# Altium schematic sheet main.SchDoc
size A4
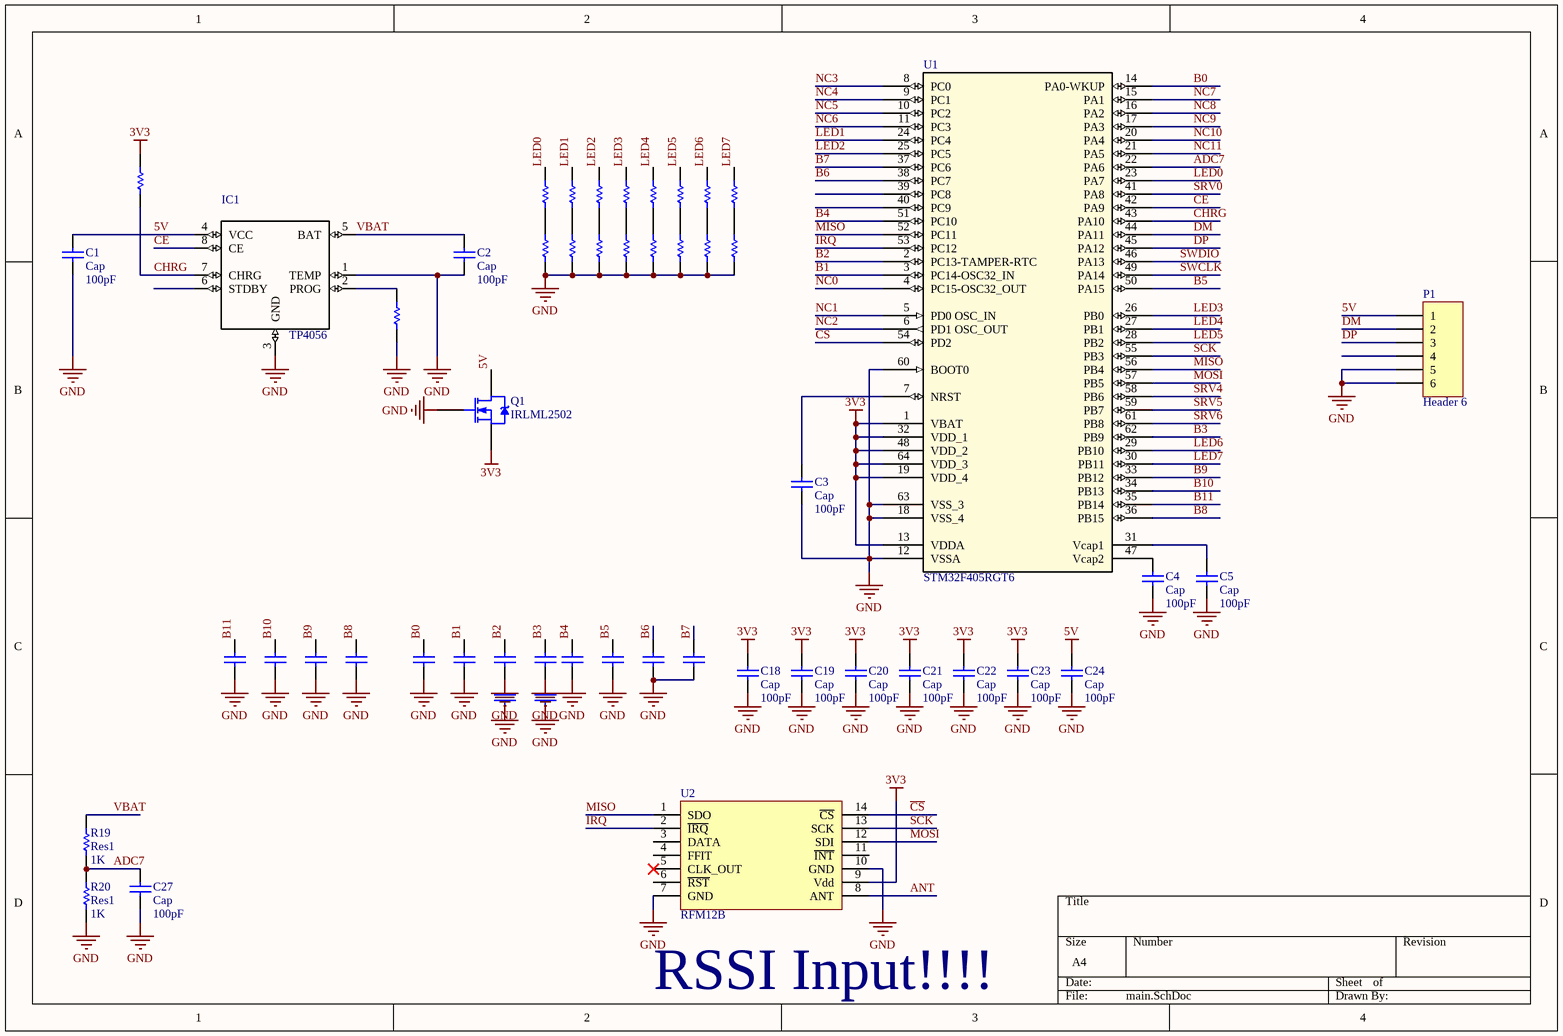
[diagram p0: main.SchDoc]

## Parts
C1  Cap  value 100pF  [RC_1210_T1.8]
C2  Cap  value 100pF  [RC_1210_T1.8]
C3  Cap  value 100pF  [RC_0603]
C4  Cap  value 100pF  [RC_0603]
C5  Cap  value 100pF  [RC_0603]
C6  Cap  [RC_0603]  (value not drawn)
C7  Cap  [RC_0603]  (value not drawn)
C8  Cap  [RC_0603]  (value not drawn)
C9  Cap  [RC_0603]  (value not drawn)
C10  Cap  [RC_0603]  (value not drawn)
C11  Cap  [RC_0603]  (value not drawn)
C12  Cap  [RC_0603]  (value not drawn)
C13  Cap  [RC_0603]  (value not drawn)
C14  Cap  [RC_0603]  (value not drawn)
C15  Cap  [RC_0603]  (value not drawn)
C16  Cap  [RC_0603]  (value not drawn)
C17  Cap  [RC_0603]  (value not drawn)
C18  Cap  value 100pF  [RC_0603]
C19  Cap  value 100pF  [RC_0603]
C20  Cap  value 100pF  [RC_0603]
C21  Cap  value 100pF  [RC_0603]
C22  Cap  value 100pF  [RC_0603]
C23  Cap  value 100pF  [RC_0603]
C24  Cap  value 100pF  [RC_0603]
C25  Cap  [RC_0603]  (value not drawn)
C26  Cap  [RC_0603]  (value not drawn)
C27  Cap  value 100pF  [RC_0603]
IC1  TP4056  [*SOP-8]
P1  Header 6  [RR_USB_MICRO_#1]
Q1  IRLML2502  [RR_SOT-23]
R1  Res1  [RR_0603]  (value not drawn)
R2  Res1  [RR_0603]  (value not drawn)
R3  Res1  [RR_0603]  (value not drawn)
R4  Res1  [RR_0603]  (value not drawn)
R5  Res1  [RR_0603]  (value not drawn)
R6  Res1  [RR_0603]  (value not drawn)
R7  Res1  [RR_0603]  (value not drawn)
R8  Res1  [RR_0603]  (value not drawn)
R9  Res1  [RR_0603]  (value not drawn)
R10  Res1  [RR_0603]  (value not drawn)
R11  Res1  [RR_0603]  (value not drawn)
R12  Res1  [RR_0603]  (value not drawn)
R13  Res1  [RR_0603]  (value not drawn)
R14  Res1  [RR_0603]  (value not drawn)
R15  Res1  [RR_0603]  (value not drawn)
R16  Res1  [RR_0603]  (value not drawn)
R17  Res1  [RR_0603]  (value not drawn)
R18  Res1  [RR_0603]  (value not drawn)
R19  Res1  value 1K  [RR_0603]
R20  Res1  value 1K  [RR_0603]
U1  STM32F405RGT6  [RR_LQFP-64]
U2  RFM12B

## Nets
3V3: C18.2 C19.2 C20.2 C21.2 C22.2 C23.2 Q1.2(S) R1.2 U1.1(VBAT) U1.13(VDDA) U1.19(VDD_4) U1.32(VDD_1) U1.48(VDD_2) U1.64(VDD_3) U2.9(Vdd)
5V: C1.2 C24.2 IC1.4(VCC) P1.1 Q1.3(D)
GND: C1.1 C2.1 C3.1 C4.1 C5.1 C6.1 C7.1 C8.1 C9.1 C10.1 C11.1 C12.1 C13.1 C14.1 C15.1 C16.1 C17.1 C18.1 C19.1 C20.1 C21.1 C22.1 C23.1 C24.1 C27.1 IC1.1(TEMP) IC1.3(GND) P1.5 P1.6 Q1.1(G) R10.1 R11.1 R12.1 R13.1 R14.1 R15.1 R16.1 R17.1 R18.1 R20.1 U1.12(VSSA) U1.18(VSS_4) U1.60(BOOT0) U1.63(VSS_3) U2.7(GND) U2.10(GND)
ADC7: C27.2 R19.1 R20.2 U1.22(PA6)
ANT: U2.8(ANT)
B0: C10.2 U1.14(PA0-WKUP)
B1: C11.2 U1.3(PC14-OSC32_IN)
B2: C12.2 U1.2(PC13-TAMPER-RTC)
B3: C13.2 U1.62(PB9)
B4: C14.2 U1.51(PC10)
B5: C15.2 U1.50(PA15)
B6: C16.2 U1.38(PC7)
B7: C17.2 U1.37(PC6)
B8: C9.2 U1.36(PB15)
B9: C8.2 U1.33(PB12)
B10: C7.2 U1.34(PB13)
B11: C6.2 U1.35(PB14)
~{CS}: U1.54(PD2) U2.14(~{CS})
CE: IC1.8(CE) U1.42(PA9)
CHRG: IC1.7(CHRG) R1.1 U1.43(PA10)
DM: P1.2 U1.44(PA11)
DP: P1.3 U1.45(PA12)
~{IRQ}: U1.53(PC12) U2.2(~{IRQ})
LED0: R2.2 U1.23(PA7)
LED1: R3.2 U1.24(PC4)
LED2: R4.2 U1.25(PC5)
LED3: R5.2 U1.26(PB0)
LED4: R6.2 U1.27(PB1)
LED5: R7.2 U1.28(PB2)
LED6: R8.2 U1.29(PB10)
LED7: R9.2 U1.30(PB11)
MISO: U1.52(PC11) U1.56(PB4) U2.1(SDO)
MOSI: U1.57(PB5) U2.12(SDI)
NC0: U1.4(PC15-OSC32_OUT)
NC1: U1.5(PD0_OSC_IN)
NC2: U1.6(PD1_OSC_OUT)
NC3: U1.8(PC0)
NC4: U1.9(PC1)
NC5: U1.10(PC2)
NC6: U1.11(PC3)
NC7: U1.15(PA1)
NC8: U1.16(PA2)
NC9: U1.17(PA3)
NC10: U1.20(PA4)
NC11: U1.21(PA5)
SCK: U1.55(PB3) U2.13(SCK)
SRV0: U1.41(PA8)
SRV4: U1.58(PB6)
SRV5: U1.59(PB7)
SRV6: U1.61(PB8)
SWCLK: U1.49(PA14)
SWDIO: U1.46(PA13)
VBAT: C2.2 IC1.5(BAT) R19.2
NetC3_2: C3.2 U1.7(NRST)
NetC4_2: C4.2 U1.47(Vcap2)
NetC5_2: C5.2 U1.31(Vcap1)
NetIC1_2: IC1.2(PROG) R18.2
NetR2_1: R2.1 R10.2
NetR3_1: R3.1 R11.2
NetR4_1: R4.1 R12.2
NetR5_1: R5.1 R13.2
NetR6_1: R6.1 R14.2
NetR7_1: R7.1 R15.2
NetR8_1: R8.1 R16.2
NetR9_1: R9.1 R17.2

Not connected (* = marked no-connect by the designer): C25 1 2; C26 1 2; IC1 6(STDBY); P1 4; U1 39(PC8) 40(PC9); U2 3(DATA) 4(FFIT) 5(CLK_OUT)* 6(~{RST}) 11(~{INT})

## Notes on the sheet
- (near U2) RSSI Input!!!!
- Labels drawn without touching a wire or pin: GND

## Library data of the parts
C1-C5 C18-C24 C27 = Cap: Capacitor; Published: 8-Jun-2000; LatestRevisionDate: 17-Jul-2002; LatestRevisionNote: Re-released for DXP Platform.; PackageReference: RAD-0.3; Publisher: Altium Limited; PackageDescription: Radial Cap, Thru-Hole; 2 Leads; 0.3 in Pin Spacing
C6-C17 C25 C26 = Cap: Capacitor; Value: 100pF; Published: 8-Jun-2000; LatestRevisionDate: 17-Jul-2002; LatestRevisionNote: Re-released for DXP Platform.; PackageReference: RAD-0.3; Publisher: Altium Limited; PackageDescription: Radial Cap, Thru-Hole; 2 Leads; 0.3 in Pin Spacing
IC1 = TP4056: MF: NanJing Top Power ASIC Corp.; MP: TP4056; Package: Package Analog Devices; Price: None; Availability: Unavailable; SnapEDA_Link: https://www.snapeda.com/parts/TP4056%20/NanJing%20Top%20Power%20ASIC%20Corp./view-part/?ref=snap; Value: *
P1 = Header 6: Header, 6-Pin; LatestRevisionDate: 17-Jul-2002; LatestRevisionNote: Re-released for DXP Platform.; Publisher: Altium Limited
Q1 = IRLML2502: MOSFET N-CH 20V 4.2A SOT-23-3; Manufacturer: Infineon Technologies; Order Number: IRLML2502GTRPBF ( IRLML6246TRPBF (INFIN)); Cost: 0,52; Package: SOT-23; Value: MOSFET N-CH 20V 4.2A SOT-23-3
R1-R18 = Res1: Resistor; Value: 1K; Published: 8-Jun-2000; LatestRevisionDate: 17-Jul-2002; LatestRevisionNote: Re-released for DXP Platform.; PackageReference: AXIAL-0.3; Publisher: Altium Limited; PackageDescription: Axial Device, Thru-Hole; 2 Leads; 0.3 in Pin Spacing
R19 R20 = Res1: Resistor; Published: 8-Jun-2000; LatestRevisionDate: 17-Jul-2002; LatestRevisionNote: Re-released for DXP Platform.; PackageReference: AXIAL-0.3; Publisher: Altium Limited; PackageDescription: Axial Device, Thru-Hole; 2 Leads; 0.3 in Pin Spacing
U1 = STM32F405RGT6: MCU STM32F405RGT6; Manufacturer: ST Microelectronics; Value: IC MCU 32BIT 1MB FLASH 64LQFP; Order Number: STM32F405RGT6; Cost: 10,58; Package: 64-LQFP
U2 = Component_1